# EasyEDA Pro project smart-switch-v100.eprj, board base-board
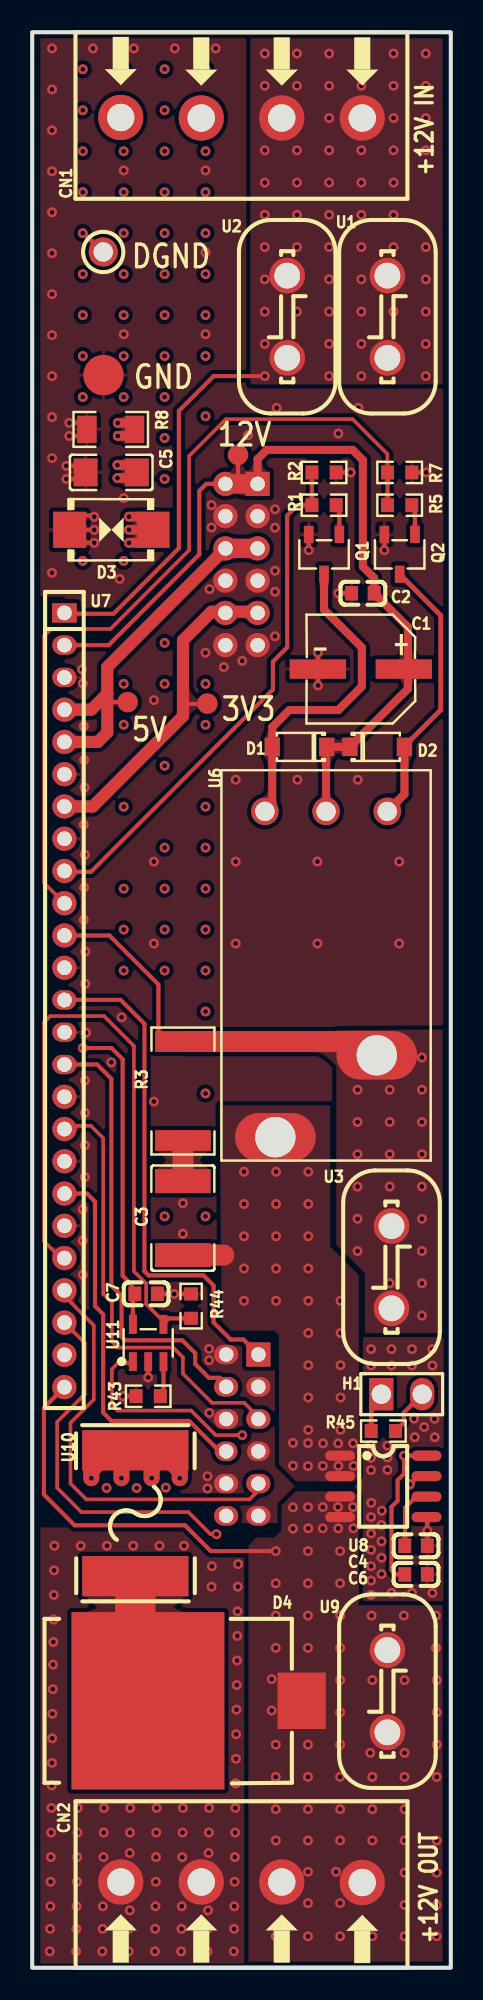
[diagram p5: board, top side]
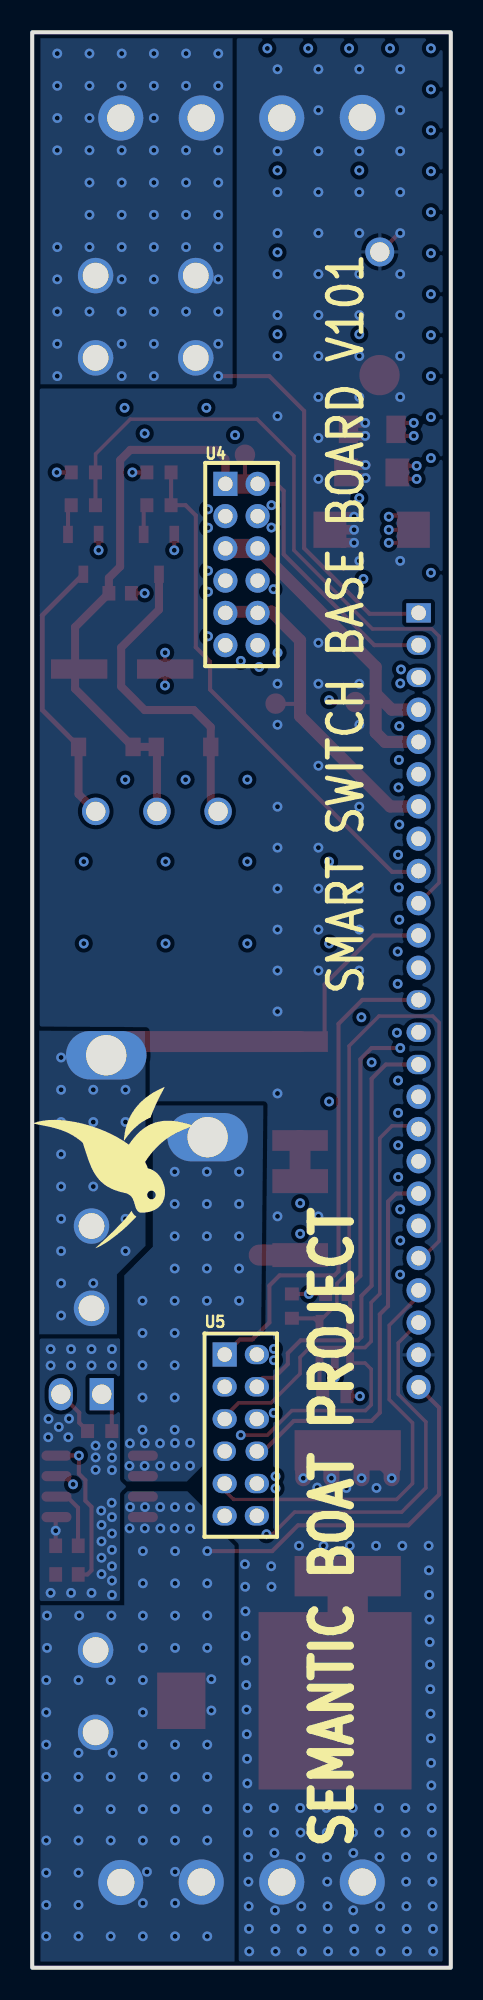
[diagram p6: board, bottom side, seen from below]

Outline 26 x 120 mm; copper layers: Top Layer, Inner1, Inner2, Bottom Layer. Coordinates in mm from the lower left corner of the outline.
Outline path: rectangle 0,120 26,0
Stack: Top Layer 0.07mm Outer layer thickness 1oz / Dielectric1 0.2104mm 7628 RC49% 8.6mil / Inner1 0.0152mm Inner layer thickness / Dielectric2 1.065mm 1.1mm H/HOZ Copper / Inner2 0.0152mm Inner layer thickness / Dielectric3 0.2104mm 7628 RC49% 8.6mil / Bottom Layer 0.07mm Outer layer thickness 1oz

## Design rules (mm)
template: Custom Config
spacing copperThickness1oz: track to track 0.102, other pairs 0.152 to 0.3
spacing copperThickness2oz (default): track to track 0.203, other pairs 0.152 to 0.3
spacing copperThicknessInner0.5oz: track to track 0.089, other pairs 0.152 to 0.3
track width copperThickness1oz: min 0.102, default 0.254, max 2.54
track width copperThickness2oz (default): min 0.203, default 0.254, max 2.54
track width copperThickness0.5oz: min 0.089, default 0.254, max 2.54
differential pair differentialPair (default): width min 0.127, default 0.254, max 2.54; gap min 0.152, default 0.152
via viaSize (default): diameter min 0.3, default 0.61, max 10; hole min 0.2, default 0.305, max 6.3

## Placement (name value [footprint] x y rotation side)
C1  100uF  [CAP-SMD_BD6.3-L6.6-W6.6-LS7.6-RD]  20.41 80.52 180 top
C2  100nF  [C0603]  20.54 85.22 0 top
C3  220nF  [C1812]  9.36 46.48 90 top
C4  100nF  [C0603]  23.84 24.38 0 top
C5  2.2nF  [C1206]  4.91 92.71 0 top
C6  1nF  [C0603]  23.84 26.16 180 top
C7  1uF  [C0603]  7.08 41.78 180 top
CN1  WJ128V-5.0-4P  [CONN-TH_4P-P5.00_WJ128V-4P-5.0-14-00A]  13 114.7 180 top
CN2  WJ128V-5.0-4P  [CONN-TH_4P-P5.00_WJ128V-4P-5.0-14-00A]  13 5.3 0 top
D1  1N4148W  [SOD-123_L2.8-W1.8-LS3.7-RD]  16.6 75.69 180 top
D2  1N4148W  [SOD-123_L2.8-W1.8-LS3.7-RD]  21.43 75.69 0 top
D3  SMBJ28CA  [SMB_L4.6-W3.6-LS5.3-BI]  4.92 89.15 180 top
D4  SM8S24A  [DO-218AB_L13.5-W8.4-LS15.5-FD]  11.96 16.55 0 top
H1  PZ254V-11-02P  [HDR-TH_2P-P2.54-V-M]  22.95 35.56 0 top
Q1  2N7002K-T1-GE3  [SOT-23-3_L2.9-W1.6-P1.90-LS2.8-BR]  18.13 87.63 90 top
Q2  2N7002K-T1-GE3  [SOT-23-3_L2.9-W1.6-P1.90-LS2.8-BR]  22.82 87.63 90 top
R1  1kΩ  [R0603]  18.13 90.68 0 top
R2  100kΩ  [R0603]  18.13 92.71 180 top
R3  100Ω  [R2512]  9.36 54.36 90 top
R5  1kΩ  [R0603]  22.82 90.68 0 top
R7  100kΩ  [R0603]  22.82 92.71 180 top
R8  1MΩ  [R1206]  4.88 95.38 180 top
R43  22kΩ  [R0603]  7.2 35.43 180 top
R44  100kΩ  [R0603]  9.87 41.02 270 top
R45  NCP18XH103F03RB  [R0603]  21.81 33.27 0 top
TP4  -  [Test-Point-0.5mm]  12.79 93.81 0 top
TP5  -  [Test-Point-0.5mm]  5.93 78.47 0 top
TP6  -  [Test-Point-0.5mm]  10.88 78.38 0 top
TP8  RH-5004  [TESTPOINT_TH_BD2.5-D1.2]  4.41 106.38 0 top
TP9  -  [Test-Point-0.5mm#2]  4.43 98.74 0 top
U1  G630-09-3T  [CONN-TH_2P-L8.2-W0.8-P5.10]  22.06 102.36 90 top
U2  G630-09-3T  [CONN-TH_2P-L8.2-W0.8-P5.10]  15.84 102.36 90 top
U3  G630-09-3T  [CONN-TH_2P-L8.2-W0.8-P5.10]  22.32 43.43 270 top
U4  2005FV-2x6P  [HDR-TH_12P-P2.00-V-F-R2-C6-S2.00#2]  13 87 270 bottom
U5  2005FV-2x6P  [HDR-TH_12P-P2.00-V-F-R2-C6-S2.00]  13.05 33.02 270 bottom
U6  PRL2-12V-DC-1A  [RELAY_PRL2-5V-DC-1A]  18.25 61.59 270 top
U7  DW200R-11-25-43  [HDR-TH_25P-P2.00-V-F-1]  2 60 270 top
U8  ACS724LLCTR-20AU-T-JSM  [SOP-8_L4.9-W3.9-P1.27-LS6.0-BL]  21.81 29.84 270 top
U9  G630-09-3T  [CONN-TH_2P-L8.2-W0.8-P5.10]  22.06 17.15 90 top
U10  BSMD3425-200-60V  [FUSE-SMD_L8.6-W6.4]  6.41 28.18 90 top
U11  SY6280AAC  [SOT-23-5_L3.0-W1.7-P0.95-LS2.8-BL]  7.2 38.74 0 top

## Footprints (pads in the part's own frame, mm; a bottom-side part is the same pattern mirrored in y, then rotated)
C0603
  rect 0.8x0.9 smd: 1(-0.7,0) 2(0.7,0)
C1206
  rect 1.485x1.728 smd: 1(-1.593,0) 2(1.593,0)
C1812
  rect 1.485x3.456 smd: 1(-2.292,0) 2(2.292,0)
CAP-SMD_BD6.3-L6.6-W6.6-LS7.6-RD
  rect 3.5x1.2 smd: 1(-2.67,0) 2(2.67,0)
CONN-TH_2P-L8.2-W0.8-P5.10
  round 2.2 hole 1.6: 1(-2.55,0) 2(2.55,0)
CONN-TH_4P-P5.00_WJ128V-4P-5.0-14-00A
  round 2.8 hole 1.7: 1(-7.5,0.015) 2(-2.5,0.015) 3(2.5,0.015) 4(7.5,-0.015)
DO-218AB_L13.5-W8.4-LS15.5-FD
  rect 3x3.5 smd: 1(4.775,0)
  rect 9.5x11 smd: 2(-4.775,0)
FUSE-SMD_L8.6-W6.4
  rect 2.5x6.6 smd: 1(-3.9,0) 2(3.9,0)
HDR-TH_2P-P2.54-V-M
  rect 1.5x2 hole 1.2: 1(-1.27,0)
  oval 1.5x2 hole 1.2: 2(1.27,0)
HDR-TH_12P-P2.00-V-F-R2-C6-S2.00
  rect 1.5x1.5 hole 0.9: 1(-5,-1)
  oval 1.2x1.5 hole 0.9: 2(-5,1) 3(-3,-1) 4(-3,1) 5(-1,-1) 6(-1,1) 9(3,-1) 10(3,1) 11(5,-1) 12(5,1)
  oval 1.2x1.4 hole 0.9: 7(1,-1) 8(1,1)
HDR-TH_12P-P2.00-V-F-R2-C6-S2.00#2
  rect 1.5x1.5 hole 0.9: 1(-5,-1)
  round 1.5 hole 0.9: 2(-5,1) 3(-3,-1) 4(-3,1) 5(-1,-1) 6(-1,1) 7(1,-1) 8(1,1) 9(3,-1) 10(3,1) 11(5,-1) 12(5,1)
HDR-TH_25P-P2.00-V-F-1
  rect 1.2x1.524 hole 0.914: 1(-24,0)
  oval 1.2x1.5 hole 0.914: 2(-22,0) 3(-20,0) 13(0,0) 14(2,0) 15(4,0)
  round 1.5 hole 0.914: 4(-18,0) 5(-16,0) 6(-14,0) 7(-12,0) 8(-10,0) 9(-8,0) 10(-6,0) 11(-4,0) 12(-2,0) 16(6,0) 17(8,0) 18(10,0) 19(12,0) 20(14,0) 21(16,0) 22(18,0) 23(20,0) 24(22,0) 25(24,0)
R0603
  rect 0.806x0.864 smd: 1(-0.753,0) 2(0.753,0)
R1206
  rect 1.208x1.701 smd: 1(-1.479,0) 2(1.479,0)
R2512
  rect 1.282x3.456 smd: 1(-3.067,0) 2(3.067,0)
RELAY_PRL2-5V-DC-1A
  round 1.708 hole 1.2: C1(-10.1,-3.8) C2(-10.1,0) C3(-10.1,3.8)
  oval 3x5 hole 2.5: COM(5.02,3.15) NO(10.1,-3.15)
SMB_L4.6-W3.6-LS5.3-BI
  rect 2.047x2.241 smd: 1(-2.591,0) 2(2.591,0)
SOD-123_L2.8-W1.8-LS3.7-RD
  rect 0.95x1.15 smd: 1(-1.692,0) 2(1.692,0)
SOP-8_L4.9-W3.9-P1.27-LS6.0-BL
  oval 0.63x1.865 smd: 1(-1.905,-2.683) 2(-0.635,-2.683) 3(0.635,-2.683) 4(1.905,-2.683) 5(1.905,2.683) 6(0.635,2.683) 7(-0.635,2.683) 8(-1.905,2.683)
SOT-23-3_L2.9-W1.6-P1.90-LS2.8-BR
  rect 1.07x0.6 smd: 1(1.235,-0.95) 2(1.235,0.95) 3(-1.235,0)
SOT-23-5_L3.0-W1.7-P0.95-LS2.8-BL
  rect 0.49x1.157 smd: 1(-0.95,-1.153) 2(0,-1.153) 3(0.95,-1.153)
  rect 0.49x1.175 smd: 4(0.95,1.153) 5(-0.95,1.153)
Test-Point-0.5mm
  round 1.27 smd: 1(0,0)
Test-Point-0.5mm#2
  round 2.5 smd: 1(0,0)
TESTPOINT_TH_BD2.5-D1.2
  round 1.8 hole 1.2: 1(0,0)

## Nets
As in the schematic.

Pads without a net: U5 12

## Via types
v1: diameter 0.61, hole 0.305, Top Layer to Bottom Layer, 472 vias

## Routing (per net, layer and track width the routed paths; a pad name or vN(x,y) marks a point on that pad's centre or on a via; arc(x,y) is an arc through that point)
+3V3: length 21.3
  Top Layer w0.254: 9.36,78.36 10.86,78.36 TP6.1
  Top Layer w0.75: U4.9 13.93,84.07 11.14,84.07 9.36,82.3 9.36,77.6 3.77,72 U7.7
+5V: length 65.2
  Top Layer w0.254: v1(3.14,57.02) 4.92,57.02 5.62,56.32 5.62,42.9 6.19,42.33 6.19,41.97 C7.2 6.25,41.66 U11.5 ; 4.66,78.48 4.68,78.47 TP5.1
  Top Layer w0.75: 4.66,78.99 3.67,78 U7.4 ; 4.66,78.99 4.66,80.64 12,87.98 U4.6 ; 4.66,78.99 4.66,76.58 4.08,76 U7.5
  Top Layer w1.2: U4.6 U4.5
  Inner2 w0.22: v1(3.14,57.02) 1.36,57.02 0.73,57.66 0.73,75.44 1.29,76 U7.5
+12V: length 54.1
  Top Layer w0.254: U4.2 10.81,92 10.38,91.57 10.38,87.63 4.75,82 U7.2 ; 12.79,93.55 12.79,92.33
  Top Layer w0.5: 21.24,85.22 21.24,86.17 20.54,86.87 20.54,93.47 19.9,94.11 14.57,94.11 14,93.54 U4.1 ; 21.24,85.22 23.34,83.12 23.34,79.29 D2.1 D1.1 18.25,75.65 U6.C2
  Top Layer w1.2: U4.2 U4.1
GND: length 23.2
  Top Layer w0.254: 24.54,26.03 v1(24.54,27.1) 24.54,27.89 U8.5 ; R44.1 v1(8.82,41.77) 7.79,41.77 C7.1 ; C2.1 v1(19.01,85.22) ; v1(17.75,81.53) 17.75,80.77 18,80.52 17.75,80.27 v1(17.75,79.5) ; Q2.2 v1(21.88,87.88) ; v1(7.2,36.6) U11.2 ; v1(2.3,95.78) 2.99,95.78 3.4,95.38 2.99,94.97 v1(2.3,94.97) ; v1(2.12,92.3) 2.91,92.3 C5.1 2.91,93.12 v1(2.12,93.12) ; 2.33,89.15 D3.2 3.22,90.04 3.77,90.04 v1(3.85,89.96) ; 2.33,89.15 v1(3.85,89.15) ; 2.33,89.15 3.14,88.34 v1(3.85,88.34) ; Q1.2 v1(17.18,87.88) ; R2.1 v1(19.78,92.71) ; v1(5.65,35.43) R43.2 ; R7.1 v1(24.48,92.71)
  vias: v1(1.24,119) v1(1.24,116.46) v1(1.24,113.92) v1(1.24,111.38) v1(1.24,108.84) v1(1.24,106.3) v1(1.24,103.76) v1(1.24,101.22) v1(1.24,98.68) v1(1.24,96.14) v1(1.24,93.6) v1(1.24,86.49) v1(3.09,80.5) v1(3.14,79.63) v1(3.14,47.02) v1(3.14,45.08) v1(3.15,42.97) v1(3.2,76.98) v1(3.22,74.88) v1(3.25,73.18) v1(3.2,70.87) v1(3.22,66.98) v1(3.2,64.98) v1(3.27,69) v1(3.3,63) v1(3.3,61) v1(3.34,57.97) v1(3.27,55.01) v1(3.27,53) v1(3.27,50.99) v1(3.27,49.02) v1(3.78,119) v1(4.92,56.13) v1(5.43,86.11) v1(5.55,58.93) v1(5.68,111.43) v1(5.68,101.27) v1(5.68,91.11) v1(6.31,119) v1(7.56,78.59) v1(7.56,68.58) v1(7.56,63.5) v1(7.56,53.71) v1(8.85,119) v1(9.36,47.4) v1(9.36,45.51) v1(10.76,111.43) v1(10.76,106.35) v1(10.76,101.27) v1(10.76,81.53) v1(10.89,30.47) v1(10.89,29.72) v1(11.01,85.47) v1(10.99,38.37) v1(10.99,37.67) v1(11,34.4) v1(11.14,90.68) v1(11.14,89.29) v1(11.4,119) v1(11.9,80.64) v1(12.64,73.66) v1(12.64,68.58) v1(12.64,63.5) v1(13.05,81.03) v1(13.4,95.02) v1(15.08,90.42) v1(15.08,89.28) v1(15.08,86.61) v1(15.08,85.31) v1(15.08,82.55) v1(15.18,96.71) v1(16.47,73.66) v1(17.72,68.58) v1(17.72,63.5) v1(19.01,95.12) v1(20.22,73.66) v1(20.26,96.71) v1(21.05,38.35) v1(21.05,37.34) v1(21.05,32.38) v1(21.05,31.62) v1(21.05,30.85) v1(21.05,27.94) v1(21.05,26.92) v1(21.05,25.91) v1(21.05,24.89) v1(21.05,24) v1(21.05,23.11) v1(21.06,28.83) v1(21.71,28.34) v1(21.7,27.45) v1(21.7,26.44) v1(21.7,25.42) v1(21.7,24.4) v1(22.06,32.37) v1(22.06,31.64) v1(22.06,30.87) v1(22.32,38.35) v1(22.32,37.34) v1(22.32,23.24) v1(22.8,68.58) v1(22.8,63.5) v1(23.59,38.35) v1(23.59,37.34) v1(23.59,23.24) v1(23.71,34.04) v1(23.76,32.89) v1(24.35,33.53) v1(24.86,38.35) v1(24.86,37.34) v1(24.86,23.24) v1(24.98,34.03) v1(25,32.89)
CUR_SENSE: length 38.1
  Top Layer w0.22: v1(11.45,26.88) 11.07,26.88 9.7,28.25 3.05,28.25 1.55,29.75 1.55,33.84 3.27,35.56 3.27,38.73 U7.23
  Top Layer w0.254: U8.7 23.97,30.48 v1(23.46,29.97)
  Inner2 w0.22: v1(23.46,29.97) 23.46,29.84 23.14,29.53 15.7,29.53 15.12,28.95 15.12,27.5 14.46,26.84 11.49,26.84 v1(11.45,26.88)
CUR_SENSE_ON: length 41.7
  Top Layer w0.22: U7.21 1.77,44 0.72,45.05 0.72,58.6 1.12,59 4.46,59 6.31,57.15 6.31,43.18 7.08,42.42 7.08,41.15 8.15,40.07 8.15,39.94
  Top Layer w0.254: U11.4 8.15,39.94 8.47,40.26 9.86,40.26 R44.2
DEV_GND: length 23.8
  Top Layer w0.254: v1(3.14,107.55) 3.2,107.55 4.39,106.36
  Top Layer w0.6: v1(6.01,89.15) D3.1 ; D3.1 6.7,88.35 v1(6.01,88.35) ; D3.1 6.7,89.97 v1(6.01,89.97) ; v1(5.32,94.97) 5.95,94.97 R8.1 5.95,95.78 v1(5.32,95.78) ; v1(5.29,93.17) 6.04,93.17 C5.2 6.15,92.36 v1(5.29,92.36)
  Top Layer w1: v1(5.54,30.35) 5.54,31.22 U10.2 ; U10.2 7.89,32.08 9.16,30.81 v1(9.16,30.35) ; U10.2 4.91,32.08 3.67,30.84 v1(3.67,30.35) ; U10.2 7.42,31.07 v1(7.42,30.35)
  vias: v1(1.14,5.33) v1(1.12,3.81) v1(1.11,2.41) v1(1.09,1.02) v1(1.24,14.22) v1(1.23,12.7) v1(1.21,11.3) v1(1.19,9.91) v1(1.18,8.38) v1(1.16,6.86) v1(1.34,23.11) v1(1.33,21.59) v1(1.31,20.19) v1(1.29,18.8) v1(1.28,17.27) v1(1.26,15.75) v1(1.38,26.16) v1(1.36,24.64) v1(2.74,2.41) v1(2.72,1.02) v1(2.82,9.91) v1(2.81,8.38) v1(2.79,6.86) v1(2.77,5.33) v1(2.76,3.81) v1(3.01,26.16) v1(3.14,117.71) v1(3.14,115.17) v1(3.14,112.63) v1(3.14,110.09) v1(3.14,105.01) v1(3.14,102.47) v1(3.14,99.93) v1(3.14,97.39) v1(3.14,87.23) v1(4.44,8.38) v1(4.42,6.86) v1(4.39,3.81) v1(4.37,2.41) v1(4.36,1.02) v1(4.46,9.91) v1(4.62,29.75) v1(4.64,26.16) v1(5.68,117.71) v1(5.68,112.63) v1(5.68,110.09) v1(5.68,107.55) v1(5.68,105.01) v1(5.68,102.47) v1(5.68,99.93) v1(5.68,97.39) v1(5.68,87.23) v1(5.68,79.61) v1(5.68,77.07) v1(5.68,71.99) v1(5.68,66.91) v1(5.68,64.37) v1(5.68,61.83) v1(6.01,2.41) v1(5.99,1.02) v1(6.09,9.91) v1(6.07,8.38) v1(6.06,7.11) v1(6.06,3.56) v1(6.28,26.16) v1(6.49,29.75) v1(7.64,2.41) v1(7.62,1.02) v1(7.72,9.91) v1(7.71,8.38) v1(7.69,6.86) v1(7.67,5.33) v1(7.66,3.81) v1(7.91,26.16) v1(8.22,117.71) v1(8.22,115.17) v1(8.22,112.63) v1(8.22,110.09) v1(8.22,107.55) v1(8.22,105.01) v1(8.22,102.47) v1(8.22,99.93) v1(8.22,97.39) v1(8.22,94.85) v1(8.22,92.31) v1(8.22,82.15) v1(8.22,79.61) v1(8.22,74.53) v1(8.22,69.45) v1(8.22,66.91) v1(8.22,64.37) v1(8.22,61.83) v1(8.22,46.59) v1(8.3,29.77) v1(9.34,8.38) v1(9.32,6.86) v1(9.29,3.81) v1(9.27,2.41) v1(9.25,1.02) v1(9.43,26.16) v1(9.36,9.91) v1(10.76,117.71) v1(10.76,112.63) v1(10.76,110.09) v1(10.76,107.55) v1(10.76,105.01) v1(10.76,102.47) v1(10.76,99.93) v1(10.76,96.19) v1(10.76,79.61) v1(10.76,77.07) v1(10.76,71.99) v1(10.76,69.45) v1(10.76,66.91) v1(10.76,64.37) v1(10.76,61.83) v1(10.76,59.29) v1(10.76,54.21) v1(10.76,46.59) v1(10.92,3.56) v1(10.9,2.41) v1(10.89,1.02) v1(10.99,9.91) v1(10.97,8.38) v1(10.95,7.11) v1(11.14,23.62) v1(11.16,24.89) v1(12.54,2.41) v1(12.52,1.02) v1(12.64,11.43) v1(12.62,9.91) v1(12.6,8.38) v1(12.59,6.86) v1(12.57,5.33) v1(12.55,3.81) v1(12.74,20.57) v1(12.72,19.05) v1(12.71,17.53) v1(12.69,16) v1(12.67,14.48) v1(12.65,12.95) v1(12.79,25.02) v1(12.77,23.62) v1(12.76,22.1)
DEV_POS_IN: length 23.6
  Top Layer w0.254: U7.1 2.05,83.95 5.04,83.95 9.11,88.01 9.11,96.52 11.27,98.68 v1(14.44,98.68)
  vias: v1(14.44,118.68) v1(14.44,116.68) v1(14.44,112.68) v1(14.44,110.68) v1(14.44,108.68) v1(14.44,106.68) v1(14.44,104.68) v1(14.44,102.68) v1(14.44,100.68) v1(16.44,118.68) v1(16.44,116.68) v1(16.44,112.68) v1(16.44,110.68) v1(16.44,108.68) v1(16.44,106.68) v1(16.44,102.68) v1(18.44,118.68) v1(18.44,116.68) v1(18.44,114.68) v1(18.44,112.68) v1(18.44,110.68) v1(18.44,108.68) v1(18.44,106.68) v1(18.44,104.68) v1(18.44,102.68) v1(18.44,100.68) v1(18.44,98.68) v1(20.44,118.68) v1(20.44,116.68) v1(20.44,112.68) v1(20.44,110.68) v1(20.44,108.68) v1(20.44,106.68) v1(20.44,104.68) v1(20.44,102.68) v1(20.44,100.68) v1(20.44,98.68) v1(22.44,118.68) v1(22.44,116.68) v1(22.44,114.68) v1(22.44,112.68) v1(22.44,110.68) v1(22.44,108.68) v1(22.44,106.68) v1(22.44,102.68) v1(24.44,118.68) v1(24.44,116.68) v1(24.44,114.68) v1(24.44,112.68) v1(24.44,106.68) v1(24.44,104.68) v1(24.44,102.68) v1(24.44,100.68) v1(24.44,98.68)
DEV_POS_OUT: length 23
  Top Layer w0.254: v1(15.13,25.83) 11.09,25.83 9.49,27.43 2.63,27.43 0.73,29.34 0.73,34.73 U7.25
  vias: v1(14.87,17.89) v1(14.87,15.95) v1(15.13,23.83) v1(15.13,21.83) v1(15.13,19.83) v1(15.13,13.83) v1(15.13,11.83) v1(15.13,9.83) v1(15.13,7.89) v1(15.13,1.95) v1(16.2,28.54) v1(16.2,27.22) v1(17.13,28.56) v1(17.13,25.83) v1(17.13,23.83) v1(17.13,21.83) v1(17.13,19.83) v1(17.13,13.83) v1(17.13,11.83) v1(17.13,9.83) v1(17.13,7.89) v1(17.13,5.95) v1(17.13,4.01) v1(17.13,1.95) v1(17.15,27.24) v1(18.04,27.24) v1(18.05,28.56) v1(18.87,5.95) v1(19,28.56) v1(19.01,27.24) v1(19.13,25.83) v1(19.13,23.83) v1(19.13,21.83) v1(19.13,19.83) v1(19.13,17.83) v1(19.13,15.83) v1(19.13,13.83) v1(19.13,11.83) v1(19.13,9.83) v1(19.13,7.89) v1(19.13,4.01) v1(19.13,1.95) v1(19.92,28.56) v1(19.95,27.24) v1(21,13.32) v1(21.08,21.83) v1(21.13,17.83) v1(21.13,11.83) v1(21.13,9.83) v1(21.13,7.89) v1(21.13,1.95) v1(23.08,21.83) v1(23.13,17.83) v1(23.13,13.32) v1(23.13,11.83) v1(23.13,9.83) v1(23.13,7.89) v1(23.13,5.89) v1(23.13,3.89) v1(23.13,1.95) v1(25.08,21.83) v1(25.08,19.83) v1(25.13,17.83) v1(25.13,15.83) v1(25.13,13.83) v1(25.13,11.83) v1(25.13,7.89) v1(25.13,5.89) v1(25.13,3.89) v1(25.13,1.95)
DEV_POS_REL_IN: length 24.3
  Top Layer w0.254: U7.11 4.8,64 7.84,60.96 7.84,57.93 8.35,57.42 R3.2
  Top Layer w1.3: R3.2 20.56,57.42 U6.COM
  vias: v1(20.21,54.44) v1(20.21,52.44) v1(20.21,50.44) v1(20.21,48.44) v1(20.21,46.44) v1(20.21,44.44) v1(22.21,54.44) v1(22.21,52.44) v1(22.21,50.44) v1(22.21,48.44) v1(22.21,42.44) v1(24.21,56.44) v1(24.21,54.44) v1(24.21,52.44) v1(24.21,50.44) v1(24.21,48.44) v1(24.21,46.44) v1(24.21,44.44) v1(24.21,42.44) v1(24.21,40.44)
RELAY_OFF: length 51.5
  Top Layer w0.22: U7.10 0.73,67.27 0.73,82.55 1.18,83 4.86,83 9.74,87.88 9.74,93.73 12.03,96.01 19.9,96.01 22.06,93.85 22.06,92.72 R7.2
  Top Layer w0.254: R5.1 R7.2
RELAY_ON: length 32.6
  Top Layer w0.254: R2.2 R1.1 16.47,90.68 15.84,90.04 15.84,81.87 14.95,80.98 14.95,79.25 3.65,67.94 2.06,67.94 U7.9
SB_RES0: length 26.1
  Top Layer w0.22: U5.9 14.02,30 14.02,29.56 13.49,29.04 3.37,29.04 2.38,30.02 2.38,33.78 3.82,35.23 3.82,39.83 2,41.65 U7.22
SMBUS_ALERT: length 24
  Top Layer w0.254: U7.19 3.4,48 3.9,47.5 3.9,41.02 4.41,40.51 4.41,34.42 4.93,33.9 9.75,33.9 11.63,32.02 U5.8
SMBUS_CLK: length 31.5
  Top Layer w0.254: U5.1 13.11,38.95 12.32,38.95 11.27,40 11.27,42.29 10.63,42.93 7.23,42.93 6.97,43.18 6.97,58.52 5.49,60.01 2.01,60.01 U7.13
SMBUS_DATA: length 27.5
  Top Layer w0.22: U7.17 2,52.13 2.07,52.2 3.65,52.2 4.41,51.44 4.41,41.78 4.95,41.24 4.95,38.83 5.33,38.45 8.76,38.45 9.36,37.85 9.36,36.83 11.17,35.03 13.17,35.03 14.05,34.15 U5.5
STACK_ENABLED: length 27.8
  Top Layer w0.254: U7.15 4.04,56 4.92,55.12 4.92,42.29 5.55,41.66 5.55,39.12 5.77,38.9 9.32,38.9 10.12,38.1 10.12,37.43 10.98,36.58 11.65,36.58 12.05,36.18 U5.4
$1N23159: length 1.9
  Top Layer w0.254: Q1.1 19.08,90.48 R1.2
$1N23163: length 1.9
  Top Layer w0.254: 23.78,88.86 23.78,90.48 R5.2
$1N23164: length 20
  Top Layer w0.5: Q1.3 18.13,84.2 20.47,81.85 20.47,79.44 19.01,77.98 15.97,77.98 14.91,76.92 D1.2 14.91,72.15 U6.C1
$1N23167: length 2.5
  Top Layer w1.3: R3.1 9.36,48.77 C3.2
$1N23168: length 2.5
  Top Layer w1.3: C3.1 11.9,44.18
  vias: v1(13.15,49.35) v1(13.15,47.35) v1(13.15,45.35) v1(13.15,43.35) v1(13.15,41.35) v1(15.15,49.35) v1(15.15,47.35) v1(15.15,45.35) v1(15.15,43.35) v1(15.15,41.35) v1(16.2,32.54) v1(16.2,31.12) v1(17.13,32.53) v1(17.13,31.1) v1(17.15,49.35) v1(17.15,47.35) v1(17.15,45.35) v1(17.15,43.35) v1(17.15,41.35) v1(17.15,39.35) v1(17.15,37.35) v1(17.15,35.35) v1(17.15,33.35) v1(18.06,32.51) v1(18.05,31.12) v1(19,32.51) v1(19.02,31.12) v1(19.15,41.35) v1(19.15,39.35) v1(19.15,37.35) v1(19.15,35.35) v1(19.15,33.35) v1(19.93,32.51) v1(19.96,31.12)
$1N23707: length 4.1
  Top Layer w0.254: 23.14,26.03 23.15,26.05 23.15,28.52 23.84,29.21 U8.6
$1N23801: length 17.1
  Top Layer w0.3: Q2.3 25.38,83.84 25.38,77.99 23.12,75.73
  Top Layer w0.5: D2.2 23.12,72.76 U6.C3
$1N27997: length 8.1
  Top Layer w2.5: D4.2 6.41,17.33 U10.1
$1N39427: length 35.9
  Top Layer w0.22: v1(13.05,33.02) 11.4,33.02 9.87,34.54 5.3,34.54 4.95,34.9 4.95,37.11 5.33,37.49 6.17,37.49 U11.1
  Top Layer w0.254: 23.14,24.38 22.57,24.38 22.32,24.64 22.32,28.57 22.7,28.96 22.7,30.23 23.1,30.63 v1(23.1,31.75) U8.8
  Inner2 w0.22: v1(23.1,31.75) 23.1,30.63 22.5,30.03 15.78,30.03 14.79,31.02 13.52,31.02 13.05,31.5 v1(13.05,33.02)
$1N40878: length 1.8
  Top Layer w0.254: 8.08,35.81 8.15,35.88 U11.3
$1N41202: length 3
  Top Layer w0.254: H1.2 23.08,34.42 23.08,33.79 R45.2
$1N41212: length 2.5
  Top Layer w0.254: R45.1 21.06,34.93 H1.1

## Copper pours and planes (outline as drawn; the poured copper is in the pictures)
GND on Top Layer: 19.27,40 27.65,40 27.65,21.72 19.27,21.72
GND on Top Layer: 19.4,40.51 27.4,40.51 27.4,21.46 19.4,21.46
GND on Top Layer: -1.81,119.63 27.14,119.63 27.14,27.56 -1.81,27.56
GND on Bottom Layer: 19.9,39.62 26.38,39.62 26.38,22.1 19.9,22.1
GND on Inner1: 19.14,40.13 27.02,40.13 27.02,21.72 19.14,21.72
GND on Inner1: -1.94,119.63 27.52,119.63 27.52,27.31 -1.94,27.31
GND on Inner2: 20.03,39.62 26.25,39.62 26.25,22.22 20.03,22.22
DEV_GND on Top Layer: -1.56,27.56 13.81,27.56 13.81,-1.02 -1.56,-1.02
DEV_GND on Bottom Layer: -1.31,119.63 28.16,119.63 28.16,0.38 -1.31,0.38
DEV_GND on Inner1: -1.56,28.57 13.94,28.57 13.94,-1.02 -1.56,-1.02
DEV_GND on Inner2: -2.7,120.9 26.89,120.9 26.89,0.38 -2.7,0.38
DEV_POS_IN on Top Layer: 13.55,119.63 25.49,119.63 25.49,98.17 13.55,98.17
DEV_POS_IN on Bottom Layer: 13.55,119.63 25.49,119.63 25.49,98.17 13.55,98.17
DEV_POS_IN on Inner1: 13.55,119.63 25.49,119.63 25.49,98.17 13.55,98.17
DEV_POS_IN on Inner2: 13.55,119.63 25.49,119.63 25.49,98.17 13.55,98.17
DEV_POS_OUT on Top Layer: 13.43,29.54 25.49,29.54 25.49,0.38 13.43,0.38
DEV_POS_OUT on Bottom Layer: 13.43,29.54 25.49,29.54 25.49,0.38 13.43,0.38
DEV_POS_OUT on Inner1: 13.43,29.01 25.49,29.01 25.49,0.38 13.43,0.38
DEV_POS_OUT on Inner2: 13.43,29.03 25.49,29.03 25.49,0.38 13.43,0.38
DEV_POS_REL_IN on Top Layer: 18.89,58.17 25.49,58.17 25.49,39.34 18.89,39.34
DEV_POS_REL_IN on Bottom Layer: 18.96,58.1 25.56,58.1 25.56,39.27 18.96,39.27
DEV_POS_REL_IN on Inner1: 18.89,58.17 25.49,58.17 25.49,39.34 18.89,39.34
DEV_POS_REL_IN on Inner2: 18.89,58.17 25.49,58.17 25.49,39.34 18.89,39.34
$1N23168 on Top Layer: 11.64,53.47 20.28,53.47 20.28,30.15 11.64,30.15
$1N23168 on Bottom Layer: 11.64,53.47 20.28,53.47 20.28,30.15 11.64,30.15
$1N23168 on Inner1: 11.64,53.47 20.28,53.47 20.28,30.61 11.64,30.61
$1N23168 on Inner2: 11.64,53.47 20.28,53.47 20.28,30.61 11.64,30.61

Small or netless copper shapes (teardrops, artwork), in the pictures only: 148 on Top Layer, 6 on Inner2

## Text on the board
Bottom Silkscreen Layer: SMART SWITCH BASE BOARD V101 | SEMANTIC BOAT PROJECT
Top Silkscreen Layer: +12V IN | +12V OUT | DGND | 5V | GND | 12V | 3V3
